# Altium schematic sheet Serial.SchDoc
size A4; SheetNumber: 2; SheetTotal: 4
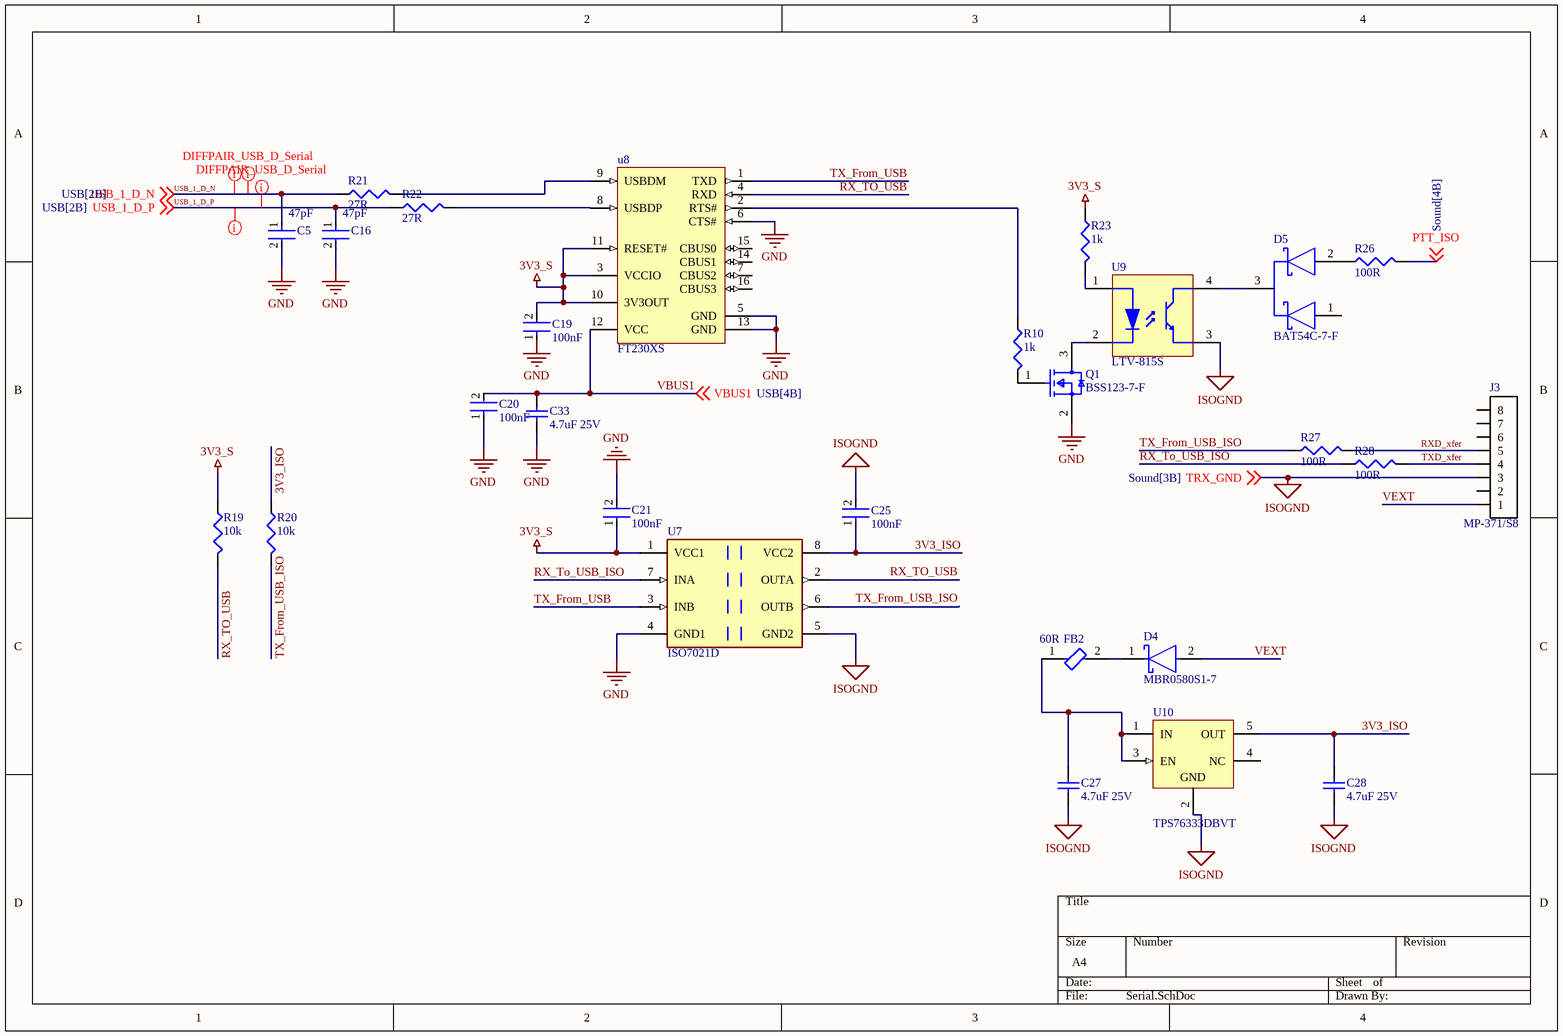
[diagram p0: Serial.SchDoc]

## Parts
C5  Capacitance: 47pF  [FP-CL10-IPC_C]  (hidden comment: CL10C470JC8NNNC)
C16  Capacitance: 47pF  [FP-CL10-IPC_C]  (hidden comment: CL10C470JC8NNNC)
C19  Capacitance: 100nF  [FP-CL10-IPC_B]  (hidden comment: CL10B104KC8NNNC)
C20  Capacitance: 100nF  [FP-CL10-IPC_B]  (hidden comment: CL10B104KC8NNNC)
C21  Capacitance: 100nF  [FP-CL10-IPC_B]  (hidden comment: CL10B104KC8NNNC)
C25  Capacitance: 100nF  [FP-CL10-IPC_B]  (hidden comment: CL10B104KC8NNNC)
C27  4.7uF 25V  [CAPC1210(3225)220_M]
C28  4.7uF 25V  [CAPC1210(3225)220_M]
C33  4.7uF 25V  [CAPC1210(3225)220_M]
D4  MBR0580S1-7  [FP-SOD123-MFG]
D5  BAT54C-7-F  [FP-SOT23-IPC_B]
FB2  Impedance: 60R  [FP-BLM41-0_2-IPC_B]  (hidden comment: BLM41PG600SN1L)
J3  MP-371/S8  [MiniDIN8_TopSolder_Lumberg]
Q1  BSS123-7-F  [FP-SOT23-IPC_C]
R10  1k  [J1-0603]
R19  10k  [J1-0603]
R20  10k  [J1-0603]
R21  27R  [J1-0603]
R22  27R  [J1-0603]
R23  1k  [J1-0603]
R26  100R  [J1-0603]
R27  100R  [J1-0603]
R28  100R  [J1-0603]
U7  ISO7021D  [FP-D0008A-IPC_B]
u8  FT230XS  [FTDI-SSOP-16_L]
U9  LTV-815S  [LTST-LTV-817S-4_V]
U10  TPS76333DBVT  [DBV0005A_N]

## Nets
3V3_S: C19.2 C21.1 R19.1 R23.1 U7.1(VCC1) u8.3(VCCIO) u8.10(3V3OUT) u8.11(RESET#)
GND: C5.2 C16.2 C19.1 C20.1 C21.2 C33.2 Q1.2(S) U7.4(GND1) u8.5(GND) u8.6(CTS#) u8.13(GND)
ISOGND: C25.2 C27.2 C28.2 J3.3 U7.5(GND2) U9.3(EMITTER) U10.2(GND) ; off-sheet TRX_GND  [also labelled TRX_GND]
3V3_ISO: C25.1 C28.1 R20.1 U7.8(VCC2) U10.5(OUT)
PTT_ISO: R26.2 ; off-sheet PTT_ISO
RX_TO_USB: R19.2 U7.2(OUTA) u8.4(RXD)
RX_To_USB_ISO: R28.1 U7.7(INA)
RXD_xfer: J3.5 R27.2
TX_From_USB: U7.3(INB) u8.1(TXD)
TX_From_USB_ISO: R20.2 R27.1 U7.6(OUTB)
TXD_xfer: J3.4 R28.2
USB_1_D_N: C5.1 R21.1 ; off-sheet USB_1_D_N
USB_1_D_P: C16.1 R22.1 ; off-sheet USB_1_D_P
VBUS1: C20.2 C33.1 u8.12(VCC) ; off-sheet VBUS1
VEXT: D4.2(A) J3.1
NetC27_1: C27.1 FB2.1 U10.1(IN) U10.3(EN)
NetD4_1: D4.1(C) FB2.2
NetD5_2: D5.2(2_ANODE) R26.1
NetD5_3: D5.3(COMMON_CATHODE) U9.4(COLLECTOR)
NetQ1_1: Q1.1(G) R10.2
NetQ1_3: Q1.3(D) U9.2(CATHODE)
NetR10_1: R10.1 u8.2(RTS#)
NetR21_2: R21.2 u8.9(USBDM)
NetR22_2: R22.2 u8.8(USBDP)
NetR23_2: R23.2 U9.1(ANODE)

Not connected (* = marked no-connect by the designer): D5 1(1_ANODE); J3 2 6 7 8; u8 7(CBUS2) 14(CBUS1) 15(CBUS0) 16(CBUS3); U10 4(NC)

## Layout directives
net class USB_Diff: USB_1_D_N, USB_1_D_P
differential pair: USB_1_D_N, USB_1_D_P

## Library data of the parts
C5 C16 = CMP-13271-001416-1: Cap Ceramic 47pF 100V C0G ±5% Pad SMD 0603 +125°C T/R; Tolerance: 5%; Packaging: Tape and Reel; Thickness: 0.035inch; Dielectric: C0G; Max Operating Temperature: 125°C; Radiation Hardening: No; Width: 0.031inch; Height: 0.8mm; Voltage Rating: 100V; Case Code (Imperial): 0603; Voltage Rating (DC): 100V; Case/Package: 0603; Case Code (Metric): 1608; Min Operating Temperature: -55°C; Material: Ceramic; Length: 1.6mm; Mount: Surface Mount; Depth: 0.8mm; JLCPCBPartNum: C1671
C19-C21 C25 = CMP-13271-004036-1: Cap Ceramic 100nF 100V X7R ±10% Pad SMD 0603 +125°C T/R; Mount: Surface Mount; Packaging: Cut Tape; Width: 0.031inch; Thickness: 0.035inch; Length: 0.063inch; Tolerance: 10%; Min Operating Temperature: -55°C; Case/Package: 0603; Voltage Rating: 100V; Max Operating Temperature: 125°C; Case Code (Metric): 1608; Case Code (Imperial): 0603; JLCPCBPartNum: C15725
C27 C28 C33 = CMP-1038-02151-2: CAP 4.7uF 25V ±10% 1210 (3225 Metric) Thickness 2.2mm SMD; Case-Metric: 3225; Case-EIA: 1210; Tolerance: Â±10%; Value: 4.7uF; Technology: SMT; Max Thickness: 2.2 mm; Rated Voltage: 25 V; JLCPCBPartNum: C86052
D4 = CMP-12790-000046-1: DIODE SCHOTTKY 80V 500MA SOD123; Manufacturer: Diodes; Standoff Height: 0mm; Max Surge Forward Current: 14A; Peak Reverse Current: 0.5uA; Capacitance: 15pF; Forward Current: 0.5A; Max Junction Temp: +175°C; Value: 15pF; RoHS: TRUE; Temperature Range High: +175°C; Octopart: https://octopart.com/mbr0580s1-7-diodes+inc.-53081572; Max Repetitive Reverse Voltage: 80V; Height: 1.45mm; Digikey Description: DIODE SCHOTTKY 80V 500MA SOD123; Mouser Description: Schottky Diodes & Rectifiers SBR 0.5A 80Vrrm 14A Ifsm 80Vrrm 15pF; Device Class L2: Diodes; Device Class L1: Discrete Semiconductors; Automotive: No; Reverse Voltage: 80V; Category: Diode; Lead Free: Yes; Footprint Url: https://www.diodes.com/assets/Package-Files/SOD123.pdf; ComponentLink2Description: Datasheet; ComponentLink2URL: https://www.diodes.com/assets/Datasheets/MBR0580S1.pdf; Device Class L3: Schottky Diodes; Manufacturer Part Number: MBR0580S1-7; Package: SOD123; Temperature Range Low: -55°C; Temperature: -55°C to +175°C; JLCPCBPartNum: C177047
D5 = CMP-12790-000084-1: DIODE ARRAY SCHOTTKY 30V SOT23-3; Max Reverse Current: 2uA; Power Dissipation: 200mW; Average Rectified Current: 200mA; Capacitance: 10pF; Peak Non-Repetitive Surge Current: 600mA; Forward Voltage: 800mV; Reverse Recovery Time: 5ns; Element Configuration: Common Cathode; Max Operating Temperature: 150°C; Max Reverse Voltage (DC): 30V; Power Rating: 200mW; Termination: SMD/SMT; REACH SVHC: No SVHC; Voltage Rating (DC): 30V; Series: -; Current Rating: 200mA; RoHS Compliant: Yes; Max Power Dissipation: 200mW; Case/Package: SOT-23; Max Repetitive Reverse Voltage (Vrrm): 30V; Width: 1.3mm; Min Operating Temperature: -65°C; Lead Free: Lead Free; Forward Current: 200mA; Number of Pins: 3; Contact Plating: Tin; Package Quantity: 3000; Length: 2.9mm; Radiation Hardening: No; Max Forward Surge Current (Ifsm): 600mA; Height: 1mm; Packaging: Tape and Reel; Mount: Surface Mount; Weight: 0.000282oz; JLCPCBPartNum: C134405
FB2 = CMP-0686-00754-3: Ferrite Bead, 1806, 60Ω @ 100MHz, 0.009Ω, 6A; Manufacturer Series: BLM41P; Tolerance: 25%; Number of Lines: 1; Shielding: Unshielded; DC Resistance-Max: 9mR; Test Frequency: 100MHz; Case Code (Imperial): 1806; Height: 1.6mm; REACH SVHC: No SVHC; Radiation Hardening: No; Core Material: Ferrite; Case Code (Metric): 4516; Frequency: 100MHz; Number of Circuits: 1; Termination: SMD/SMT; Contact Plating: Tin; Width: 1.6mm; Number of Pins: 2; Package Quantity: 1; Series: BLM41P; Max DC Current: 6A; Inductor Type: FERRITE BEAD; Case/Package: 1806; DC Current: 6A; Number of Functions: 1; Length: 4.5mm; DC Resistance (DCR): 9mR; Terminal Finish: Tin; Military Standard: Not; Min Operating Temperature: -55°C; Depth: 1.6mm; Lead Free: Lead Free; Current: 6A; RoHS Compliant: Yes; Max Current Rating: 6A; Current Rating: 6A; Max Operating Temperature: 125°C; Packaging: Tape and Reel; Material: Ferrite; JLCPCBPartNum: C85844
J3 = MiniDin8_SMT: Miniature circular connectors MP-371/S8; Digikey_PartNum: 2057-MDP-008-ND
Q1 = CMP-12801-000017-1: MOSFET N-CH 100V 170MA SOT23-3; Manufacturer: Diodes Incorporated; Standoff Height: 0.013mm; Power Dissipation: 300mW; Gate To Source Voltage: 20V; Transconductance: 0.37S; Pulse Drain Current: 680mA; Max Forward Diode Voltage: 1.3V; Input Capacitace At Vds: 22pF @ 25V; Number Of N Channels: 1; Threshold Vgs Min: 0.8V; Threshold Vgs Max: 2V; Turn On Delay Time: 8ns; Depletion Mode: False; Typ Forward Diode Voltage: 0.84V; Drain To Source Resistance: 6Ω; Max Junction Temp: +150°C; Rthja Max: 417°C/W; Turn Off Delay Time: 13ns; Automotive Grade: NA; Lead Free: Yes; Manufacturer Part Number: BSS123-7-F; Device Class L1: Discrete Semiconductors; Footprint Url: https://www.diodes.com/assets/Package-Files/SOT23.pdf; Automotive: No; ComponentLink2Description: Datasheet; Octopart: https://octopart.com/bss123-7-f-diodes+inc.-335886; Mouser Description: MOSFET 100V 360mW; RoHS: TRUE; Temperature Range Low: -55°C; Number Of Channels: 1; Device Class L3: MOSFETs; Temperature Range High: +150°C; Drain To Source Breakdown Voltage: 100V; Package: SOT23; Temperature: -55°C to +150°C; Continuous Drain Current: 170mA; Category: Trans; Drain To Source Voltage: 100V; ComponentLink2URL: https://www.diodes.com/assets/Datasheets/ds30366.pdf; Height: 1.1mm; Digikey Description: MOSFET N-CH 100V 170MA SOT23-3; Device Class L2: Transistors; JLCPCBPartNum: C85107
R10 R19-R23 R26-R28 = Res3: Resistor; Published: 8-Jun-2000; LatestRevisionDate: 29-May-2009; LatestRevisionNote: IPC-7351 Footprint Added.; PackageReference: J1-0603; Publisher: Altium Limited; PackageDescription: Chip Resistor
  R10 R23: Value: 1k; JLCPCBPartNum: C21190
  R19 R20: Value: 10k; JLCPCBPartNum: C25804
  R21 R22: Value: 27R; JLCPCBPartNum: C192531
  R26-R28: Value: 100R; JLCPCBPartNum: C22775
U7 = CMP-04872-000022-1: DGTL ISO 3000VRMS 2CH GP 8SOIC
u8 = CMP-2000-06288-1: USB to Basic UART IC, 2.97 to 5.5 V, -40 to 85 degC, 16-Pin SSOP, RoHS; Manufacturer: FTDI; Data Rate: 3Mbaud; USB Standard: USB2.0; USB Type: Transceiver; No. of Pins: 16Pins; Supply Voltage Max: 5.5V; SVHC: NoSVHC(17-Dec-2015); Supply Voltage Min: 2.97V; MSL: MSL3-168hours; Datasheet Version: Rev. 1.4, 05/2016; Interface Case Style: SSOP; Datasheet URL: http://www.ftdichip.com/Support/Documents/DataSheets/ICs/DS_FT230X.pdf; Packaging: CutTape; Package Description: 16-Pin Shrink Small Outline Package Integrated Circuit, Body 4.9 x 3.9 mm, Pitch 0.635 mm; Operating Temperature Min: -40°C; Mounting Technology: SurfaceMount; Package Reference: SSOP-16; Manufacturer URL: http://www.ftdichip.com/; Product Range: -; Operating Temperature Max: 85°C; No. of Ports: -; JLCPCBPartNum: C69082
U9 = CMP-2000-05204-1: Photocoupler - Phototransistor Output, 35 V VCEO, -50 to 110 degC, 4-Pin SMD, RoHS, Tape and Reel; Manufacturer: Lite-On; Collector Current (DC): 0.05A; Collector-Emitter Voltage: 35V; Fall Time: 18000ns; Reverse Breakdown Voltage: 6V; Forward Voltage: 1.4V; Output Type: DC; Forward Current: 50mA; Isolation Voltage: 5000V; Number of Elements: 1; Rad Hardened: No; Power Dissipation: 0.2W; Current Transfer Ratio: 600%; DELETED: Compliant; Collector-Emitter Saturation Voltage: 0.2V; Package Type: PDIPSMD; Collector Current (DC) (Max): 0.05A; Manufacturer URL: http://www.us.liteon.com/; Rise Time: 18000ns; Operating Temperature Classification: Commercial; Output Device: Transistor; Input Type: DC; Datasheet Version: Jan-10; Operating Temp Range: -30Cto100C; Mounting: SurfaceMount; Pin Count: 4; JLCPCBPartNum: C115455
U10 = CMP-0394-00563-2: Single Output LDO, 150 mA, Fixed 3.3 V Output, 2.7 to 10 V Input, with Low IQ, 5-pin SOT-23 (DBV), -40 to 125 degC, Green (RoHS & no Sb/Br); Manufacturer: Texas Instruments; Vin(Max)(V): 10; Iq(Typ)(mA): 0.08; Accuracy(%): 3; Vout Adj(Max)(V): 3.3; Iout(Max)(A): 0.15; Vin(Min)(V): 2.7; Vdo(Typ)(mV): 300; SubFamily: Single Channel LDO; ComponentLink2URL: http://www.ti.com/general/docs/lit/getliterature.tsp?genericPartNumber=TPS76333&fileType=pdf; ComponentLink2Description: Datasheet; Code_JEDEC: MO-178; PartNumber: TPS76333DBVT; Vout Adj(Min)(V): 3.3; PackageDescription: 5-Pin Plastic Small Outline, Body 1.60 Ãƒâ€” 2.90 mm, Pitch 0.95 mm; Eco-Plan: Green (RoHS & no Sb/Br); PackageReference: DBV0005A; Mounting Technology: Surface Mount; ComponentLink3Description: Package Specification; DatasheetVersion: SLVS181H; ComponentLink3URL: http://www.ti.com/litv/pdf/mpds018i; PackageVersion: 4073253-4/K; Fixed Output Options(V): 3.3; ComponentLink1URL: http://www.ti.com/; ComponentLink1Description: Manufacturer URL; JLCPCBPartNum: C7100